# EAGLE design untitled (EAGLE 7.7.0)
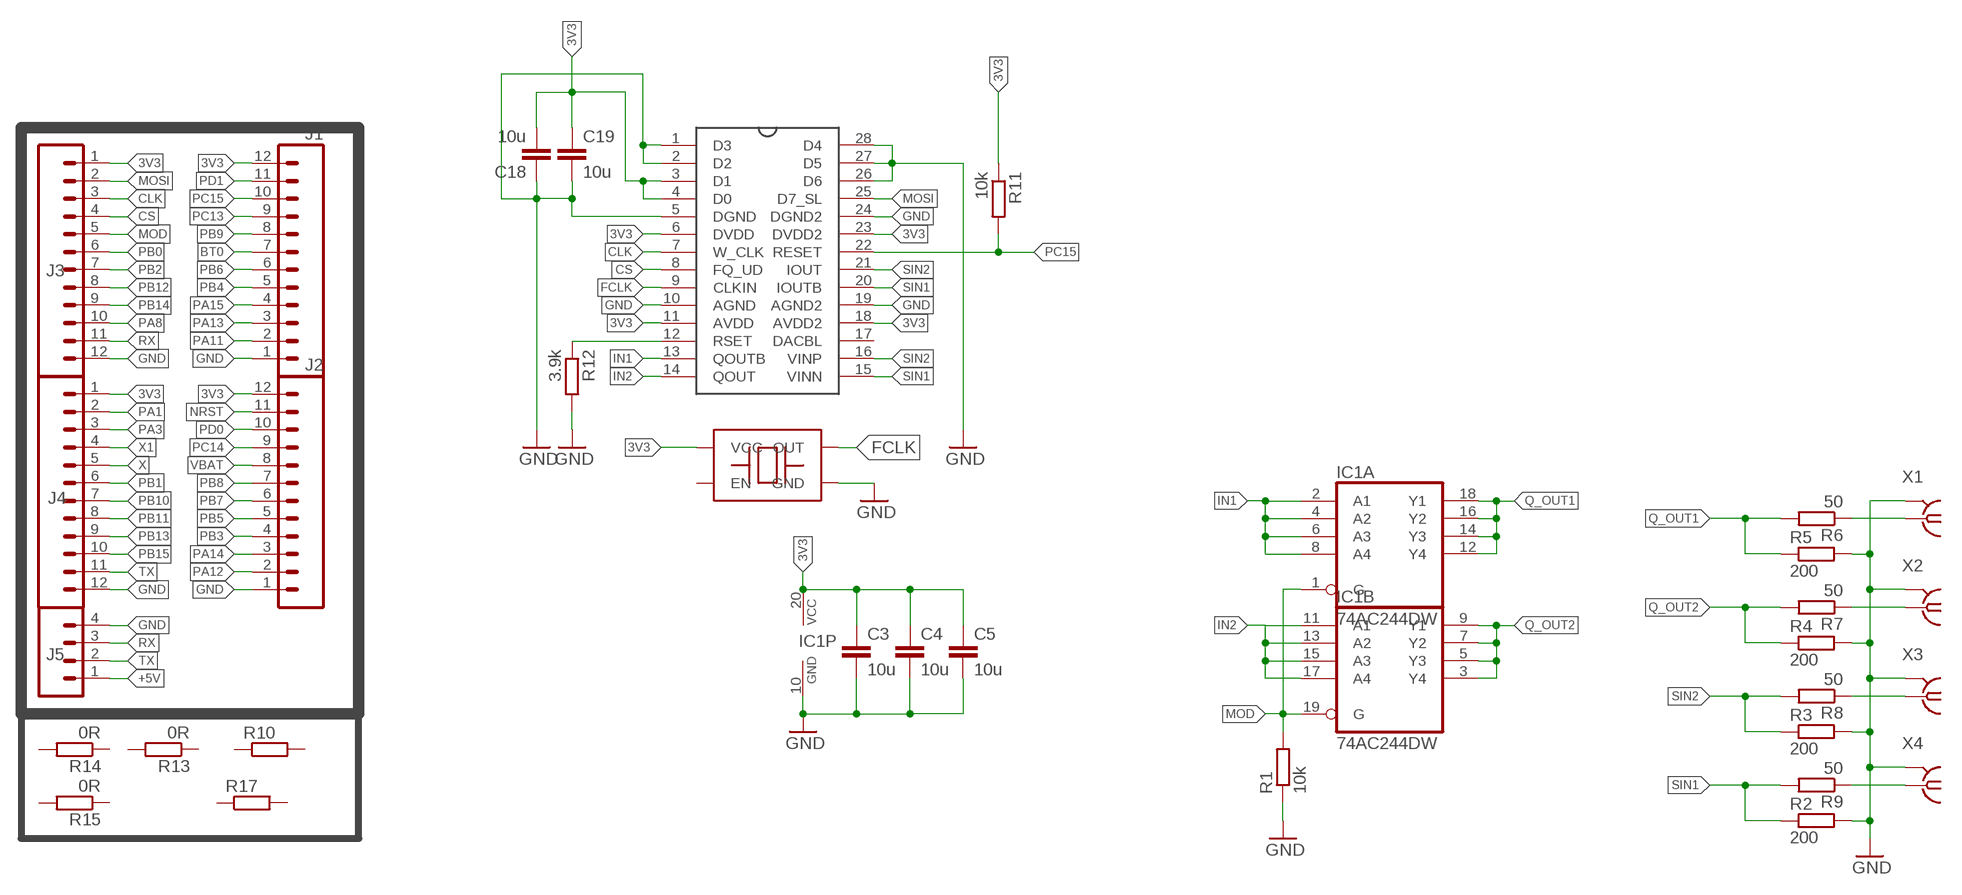
[diagram p0: schematic, sheet 1]

## Parts
C3  10u  C0805  [0805]
C4  10u  C0805  [0805]
C5  10u  C0805  [0805]
C18  10u  C0805  [0805]
C19  10u  C0805  [0805]
IC1  74AC244DW  [SO20W]
J1  M12PTH  [1X12]
J2  M12PTH  [1X12]
J3  M12PTH  [1X12]
J4  M12PTH  [1X12]
J5  M04PTH  [1X04]
R1  10k  R0805  [0805]
R2  200  R0805  [0805]
R3  200  R0805  [0805]
R4  200  R0805  [0805]
R5  200  R0805  [0805]
R6  50  R0805  [0805]
R7  50  R0805  [0805]
R8  50  R0805  [0805]
R9  50  R0805  [0805]
R10  R0805  [0805]
R11  10k  R0805  [0805]
R12  3.9k  R0805  [0805]
R13  0R  R0805  [0805]
R14  0R  R1206  [1206]
R15  0R  R0805  [0805]
R17  R1206  [1206]
U$1  AD9850  [SSOP28]
U$3  TXC-BA  [7X5]
X1  BU-SMA-H  [BU-SMA-H]
X2  BU-SMA-H  [BU-SMA-H]
X3  BU-SMA-H  [BU-SMA-H]
X4  BU-SMA-H  [BU-SMA-H]

## Nets
3V3: C3.1 C4.1 C5.1 C18.2 C19.1 IC1.20(P:VCC) J1.12 J2.12 J3.1 J4.1 R11.1 U$1.3(D1) U$1.4(D0) U$1.6(DVDD) U$1.11(AVDD) U$1.18(AVDD2) U$1.23(DVDD2) U$3.VCC
+5V: J5.1
BT0: J1.7
CLK: J3.3 U$1.7(W_CLK)
CS: J3.4 U$1.8(FQ_UD)
FCLK: U$1.9(CLKIN) U$3.OUT
GND: C3.2 C4.2 C5.2 C18.1 C19.2 IC1.10(P:GND) J1.1 J2.1 J3.12 J4.12 J5.4 R1.1 R2.2 R3.2 R4.2 R5.2 R12.2 U$1.1(D3) U$1.2(D2) U$1.5(DGND) U$1.10(AGND) U$1.19(AGND2) U$1.24(DGND2) U$1.26(D6) U$1.27(D5) U$1.28(D4) U$3.GND X1.2 X1.3 X1.4 X1.5 X2.2 X2.3 X2.4 X2.5 X3.2 X3.3 X3.4 X3.5 X4.2 X4.3 X4.4 X4.5
IN1: IC1.2(A:A1) IC1.4(A:A2) IC1.6(A:A3) IC1.8(A:A4) U$1.13(QOUTB)
IN2: IC1.11(B:A1) IC1.13(B:A2) IC1.15(B:A3) IC1.17(B:A4) U$1.14(QOUT)
MOD: IC1.1(A:G) IC1.19(B:G) J3.5 R1.2
MOSI: J3.2 U$1.25(D7_SL)
N$1: R6.1 X1.1
N$3: R7.1 X2.1
N$6: R8.1 X3.1
N$8: R9.1 X4.1
NRST: J2.11
PA1: J4.2
PA3: J4.3
PA8: J3.10
PA11: J1.2
PA12: J2.2
PA13: J1.3
PA14: J2.3
PA15: J1.4
PB0: J3.6
PB1: J4.6
PB2: J3.7
PB3: J2.4
PB4: J1.5
PB5: J2.5
PB6: J1.6
PB7: J2.6
PB8: J2.7
PB9: J1.8
PB10: J4.7
PB11: J4.8
PB12: J3.8
PB13: J4.9
PB14: J3.9
PB15: J4.10
PC13: J1.9
PC14: J2.9
PC15: J1.10 R11.2 U$1.22(RESET)
PD0: J2.10
PD1: J1.11
Q_OUT1: IC1.12(A:Y4) IC1.14(A:Y3) IC1.16(A:Y2) IC1.18(A:Y1) R5.1 R6.2
Q_OUT2: IC1.3(B:Y4) IC1.5(B:Y3) IC1.7(B:Y2) IC1.9(B:Y1) R4.1 R7.2
R_SET: R12.1 U$1.12(RSET)
RX: J3.11 J5.3
SIN1: R2.1 R9.2 U$1.15(VINN) U$1.20(IOUTB)
SIN2: R3.1 R8.2 U$1.16(VINP) U$1.21(IOUT)
TX: J4.11 J5.2
VBAT: J2.8
X: J4.5
X1: J4.4
Unconnected: R10.1 R10.2 R13.1 R13.2 R14.1 R14.2 R15.1 R15.2 R17.1 R17.2 U$1.17(DACBL) U$3.EN

## Library data of the parts
C3-C5 C18 C19 = smalsmd:C: Capacitor
IC1 = 74xx-eu:74*244: Octal BUFFER and LINE DRIVER, 3-state
J1-J4 = SparkFun-Connectors:M12: Header 12 Standard 12-pin 0.1" header. Use with straight break away headers (SKU : PRT-00116), right angle break away headers (PRT-00553), swiss pins (PRT-00743), machine pins (PRT-00117), and female headers (PRT-00115).
J5 = SparkFun-Connectors:M04: Header 4 Standard 4-pin 0.1" header. Use with straight break away headers (SKU : PRT-00116), right angle break away headers (PRT-00553), swiss pins (PRT-00743), machine pins (PRT-00117), and female headers (PRT-00115). Molex polarized connector foot print use with SKU : PRT-08231 with associated crimp pins and housings. 1MM SMD Version SKU: PRT-10208; PROD_ID: CONN-09696
R1-R15 R17 = smalsmd:R
U$1 = ad9850:AD9850: CMOS, 125 MHz Complete DDS Synthesizer
U$3 = txc:TXC-BA**
X1-X4 = con-coax:BU-SMA-H: FEMALE SMA CONNECTOR Radiall; OC_FARNELL: unknown; OC_NEWARK: unknown

## Board
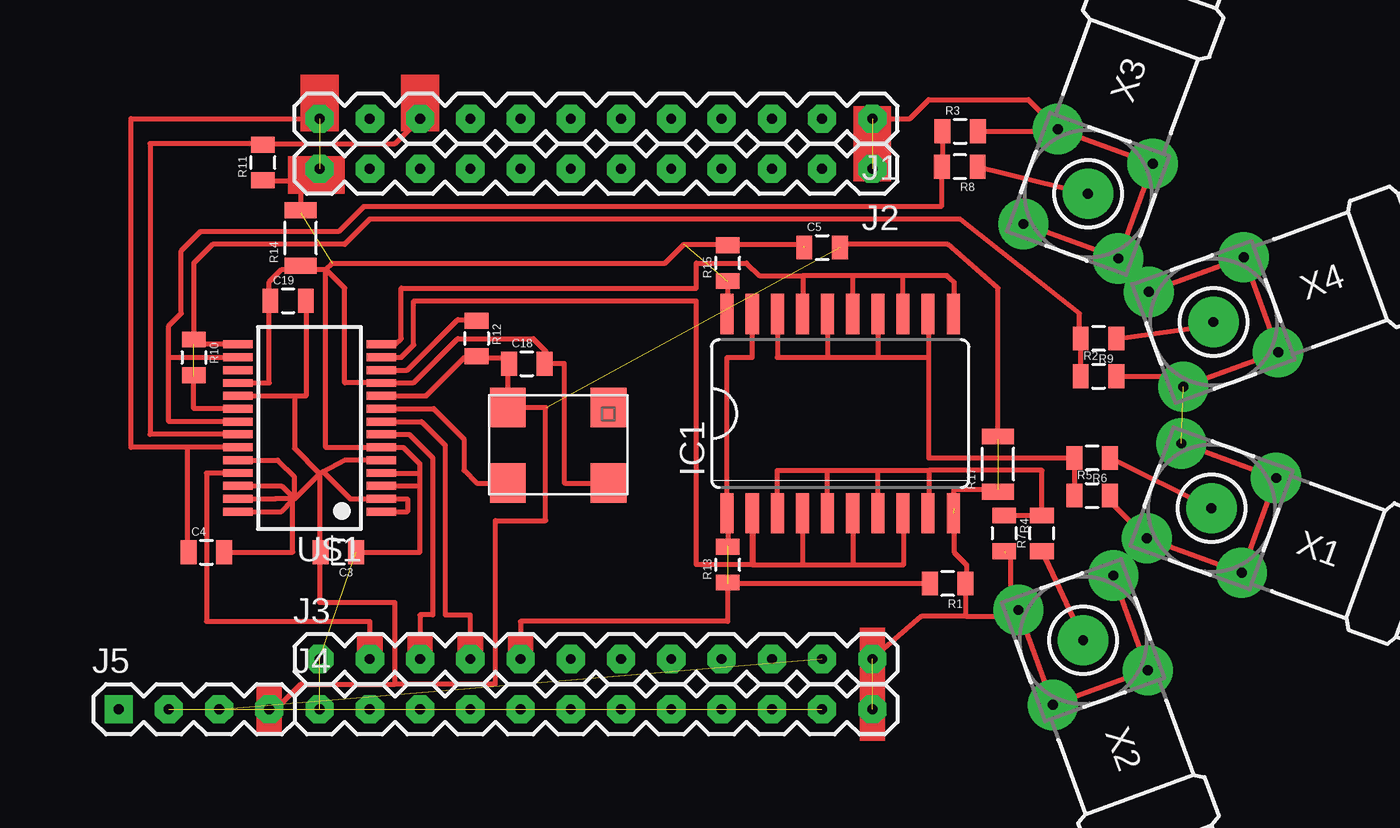
[diagram p1: board, top side]
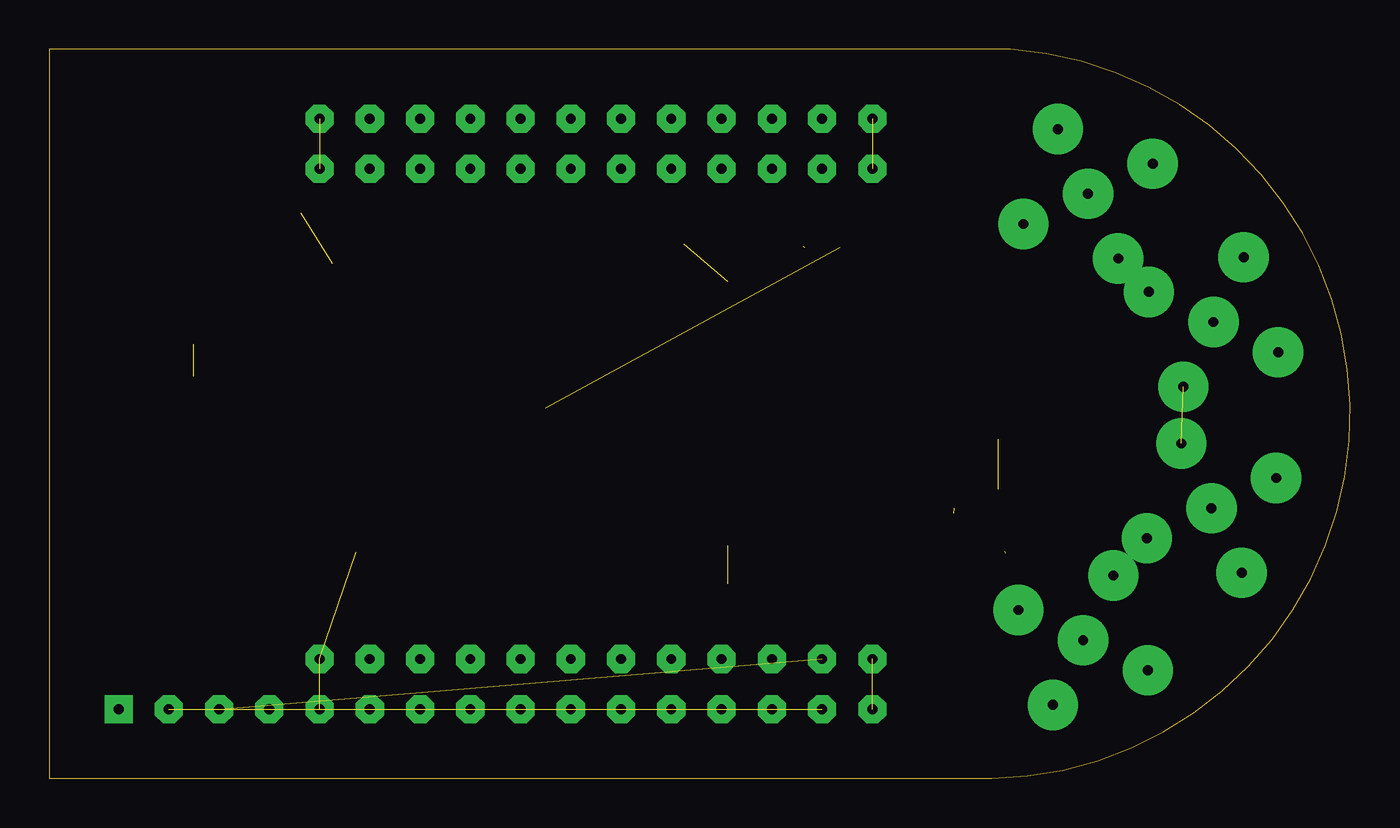
[diagram p2: board, inner layer Route3]

No outline drawn. Coordinates in mm, seen from the top.
Copper layers (1*16): Top 0.035mm / dielectric 1.5mm / Bottom 0.035mm
Design rules "default *": minimum track width 10mil, minimum drill 12.5mil, track to track 0.2mm, track to pad 0.2mm, pad to pad 0.2mm, via to via 0.2mm, smd to smd 0.2mm, copper to edge 40mil, drill to drill 8mil, minimum pad ring 10mil, minimum via ring 8mil, stop-mask expansion 4mil, vias tented up to drill 0mil, thermal gap 10mil

### Footprints (pad centres in the part's own frame; a part is rotated, then mirrored left to right if it is on the bottom)
0805 = smd 0.8 x 1.2: 1 -0.9,0; 2 0.9,0
SO20W = smd 0.66 x 2.032: 1 -5.715,-5.029; 2 -4.445,-5.029; 3 -3.175,-5.029; 4 -1.905,-5.029; 5 -0.635,-5.029; 6 0.635,-5.029; 7 1.905,-5.029; 8 3.175,-5.029; 9 4.445,-5.029; 10 5.715,-5.029; 11 5.715,5.029; 12 4.445,5.029; 13 3.175,5.029; 14 1.905,5.029; 15 0.635,5.029; 16 -0.635,5.029; 17 -1.905,5.029; 18 -3.175,5.029; 19 -4.445,5.029; 20 -5.715,5.029
1X12 = drill 0.5 pad 1.422 octagon: 1 0,0; 2 2.54,0; 3 5.08,0; 4 7.62,0; 5 10.16,0; 6 12.7,0; 7 15.24,0; 8 17.78,0; 9 20.32,0; 10 22.86,0; 11 25.4,0; 12 27.94,0
1X04 = drill 0.5 pad 1.422 square: 1 0,0 | drill 0.5 pad 1.422 octagon: 2 2.54,0; 3 5.08,0; 4 7.62,0
1206 = smd 0.8 x 1.6: 1 -1.4,0; 2 1.4,0
SSOP28 = smd 0.4 x 1.5: 1 -4.225,-3.625; 2 -3.575,-3.625; 3 -2.925,-3.625; 4 -2.275,-3.625; 5 -1.625,-3.625; 6 -0.975,-3.625; 7 -0.325,-3.625; 8 0.325,-3.625; 9 0.975,-3.625; 10 1.625,-3.625; 11 2.275,-3.625; 12 2.925,-3.625; 13 3.575,-3.625; 14 4.225,-3.625; 15 4.225,3.625; 16 3.575,3.625; 17 2.925,3.625; 18 2.275,3.625; 19 1.625,3.625; 20 0.975,3.625; 21 0.325,3.625; 22 -0.325,3.625; 23 -0.975,3.625; 24 -1.625,3.625; 25 -2.275,3.625; 26 -2.925,3.625; 27 -3.575,3.625; 28 -4.225,3.625
7X5 = smd 1.8 x 2: EN 0.953,0.635; GND 6.032,0.635; OUT 6.032,4.445; VCC 0.953,4.445
BU-SMA-H = drill 0.5 pad 2.54: 1 0,0; 2 -2.55,2.55; 3 2.55,2.55; 4 2.55,-2.55; 5 -2.55,-2.55

### Placement (x,y rotation side)
C3  13.65,9.84 180 top
C4  6.99,9.84 0 top
C5  38.1,25.24 0 top
C18  23.18,19.37 0 top
C19  11.11,22.54 0 top
IC1  39.01,16.84 0 top
J1  40.64,31.75 180 top
J2  40.64,29.21 180 top
J3  12.7,4.45 0 top
J4  12.7,1.91 0 top
J5  2.54,1.91 0 top
R1  44.45,8.26 180 top
R2  52.07,18.73 0 top
R3  45.09,31.11 0 top
R4  47.31,10.79 270 top
R5  51.75,12.7 0 top
R6  51.75,14.61 180 top
R7  49.21,10.79 90 top
R8  45.07,29.32 180 top
R9  52.07,20.64 180 top
R10  6.35,19.68 270 top
R11  9.84,29.53 90 top
R12  20.64,20.64 270 top
R13  33.34,9.21 90 top
R14  11.75,25.72 90 top
R15  33.34,24.45 90 top
R17  46.99,14.29 90 top
U$1  12.2,16.12 90 top
U$3  TXC-BA*  [7X5]  28.26,17.78 180 top
X1  57.78,12.06 340 top
X2  51.3,5.39 290 top
X3  51.55,27.95 70 top
X4  57.89,21.47 20 top

### Tracks (layer width: path | path; a pad name or v marks a point on that pad's centre or on a via)
3V3  (6 unrouted)
  Top 0.254: 8.57,18.41 U$1.18 10.16,18.39 10.16,22.49 | 15.82,18.41 U$1.11 | 13.02,24.13 10.79,24.13 10.16,23.5 10.16,22.49 | IC1.20 33.34,21.87 33.34,23.5 | U$1.23 6.03,15.14 | 6.03,15.14 3.17,15.14 3.17,31.75 J1.12 | C4.1 6.03,9.84 6.03,15.14 | 13.02,24.13 13.02,15.14 U$1.6 16.93,15.14 17.78,14.29 17.78,13.84 | 13.02,24.13 13.97,23.18 13.97,18.39 U$1.11 | 10.16,22.49 C19.1 | 11.75,28.57 9.89,28.57 R11.1 | J2.12 11.75,29.21 11.75,28.57 | 11.75,28.57 11.75,26.99 | U$1.11 15.85,18.41 17.46,18.41 19.68,20.64 23.5,20.64 24.13,20 24.13,19.42 C18.2 24.13,19.32 24.13,19.37 25.08,19.37 25.08,13.34 U$3.VCC | 13.02,24.13 13.34,24.45 30.16,24.45 31.11,25.4 37.15,25.4 37.15,25.29 | 14.61,9.89 C3.1 17.78,9.84 17.78,13.19 | U$1.4 17.78,13.84 | U$1.3 17.78,13.19 | 17.78,13.19 17.78,13.84
CLK
  Top 0.254: U$1.7 17.23,15.79 18.41,14.61 18.41,6.67 17.78,6.67 J3.3
CS
  Top 0.254: U$1.8 17.85,16.44 19.05,15.24 19.05,6.67 20.32,6.67 J3.4
FCLK
  Top 0.254: U$1.9 18.47,17.09 20,15.56 20,13.97 20.64,13.34 U$3.OUT
GND  (7 unrouted)
  Top 0.254: U$1.28 10.78,11.89 11.35,12.46 | U$1.27 10.48,12.54 11.43,12.54 | U$1.26 10.78,13.19 11.43,12.54 | 9.21,17.78 9.21,17.74 U$1.19 11.43,17.74 | IC1.10 44.77,11.81 44.77,9.84 45.4,9.21 45.4,8.31 R1.1 45.35,6.65 45.4,6.6 | U$1.24 10.59,14.49 11.43,13.65 11.43,12.54 | 11.43,17.74 11.43,15.08 12.7,13.81 | 15.82,17.78 U$1.10 18.1,17.74 20.04,19.68 20.37,19.68 | J1.1 42.55,31.75 43.5,32.7 48.54,32.7 X3.3 | X3.3 X3.4 X3.5 | X3.5 X3.2 | X3.5 X4.2 | X4.2 X4.3 X4.4 X4.5 56.36,18.73 R2.2 | X2.5 X2.4 X2.3 X2.2 X1.5 | X1.5 X1.4 X1.3 X1.2 | R3.2 49.92,31.11 X3.3 | 54.61,22.54 X4.2 | 11.35,12.46 11.43,12.54 | 11.43,12.54 12.7,13.81 | C4.2 11.35,9.84 11.35,12.46 | J5.4 10.48,1.91 11.75,3.17 16.51,3.17 | 16.51,3.17 16.51,7.3 12.7,7.3 12.7,9.84 12.7,13.81 | 16.51,3.17 21.59,3.17 21.59,11.43 24.13,11.43 24.13,17.14 U$3.GND 22.23,19.37 22.23,19.63 20.74,19.63 20.37,19.68 | 45.4,6.6 43.11,6.6 J3.12 | 47.36,9.79 47.62,9.53 47.62,7.32 X2.5 | R5.2 52.65,12.4 X1.5 | 46.99,15.56 46.99,23.18 44.45,25.4 39.05,25.4 39.05,25.29 | 44.77,12.06 44.77,13.02 46.99,13.02 | 11.43,17.74 12.01,17.74 12.01,22.49 12.06,22.49 C19.2 | 20.37,19.68 R12.2 | U$1.5 13.97,14.49 12.88,13.91 | U$1.1 17.14,11.89 17.14,12.54 U$1.2 14.25,12.54 12.88,13.91 | 12.88,13.91 12.7,13.81 | 45.4,6.6 48.03,6.6 X2.5
  Top 0.406: C3.2 12.7,9.84 | C18.1 22.23,19.37 | C5.2 39.05,25.24 39.05,25.4
IN1
  Top 0.254: 34.57,9.21 IC1.2 34.61,11.81 34.61,9.21 | 34.57,9.21 34.61,9.21 | 34.61,9.21 37.11,9.21 | 37.11,9.21 39.65,9.21 | 39.65,9.21 42.23,9.21 42.23,11.81 IC1.8 | IC1.4 37.11,9.21 | IC1.6 39.65,9.21 | 34.57,9.21 31.75,9.21 31.75,22.54 17.46,22.54 17.46,20.32 16.83,19.68 U$1.13
IN2
  Top 0.254: 42.19,23.81 44.41,23.81 44.77,23.5 IC1.11 | 42.19,23.81 39.65,23.81 | 37.15,21.87 IC1.17 37.15,21.91 37.15,23.81 | IC1.13 42.19,23.81 | 37.15,23.81 34.92,23.81 34.29,24.45 31.75,24.45 31.75,23.18 16.83,23.18 16.83,20.64 16.53,20.34 U$1.14 | IC1.15 39.65,23.81 | 39.65,23.81 37.15,23.81
MOD  (1 unrouted)
  Top 0.254: IC1.19 34.57,19.68 33.3,19.68 IC1.1 33.34,11.81 33.34,10.16 | 43.81,8.26 R1.2 43.5,8.26 33.34,8.26 33.34,6.35 22.86,6.35 J3.5
MOSI
  Top 0.254: U$1.25 6.99,13.84 6.99,6.35 15.24,6.35 J3.2
N$1
  Top 0.254: R6.1 X1.1
N$2
  Route3 0: 47.62,35.24 -0.95,35.24 -0.95,-1.59 46.67,-1.59 arc175 47.62,35.24
N$3
  Top 0.254: R7.1 X2.1
N$6
  Top 0.254: R8.1 X3.1
N$8
  Top 0.254: R9.1 57.69,21.27 X4.1
PC15
  Top 0.254: U$1.22 4.13,15.79 4.13,30.48 9.79,30.48 R11.2 | 9.84,30.48 R11.2 | R11.2 10.11,30.43 10.16,30.48 16.51,30.48 J1.10
Q_OUT1
  Top 0.254: IC1.14 40.92,19.68 | 40.92,19.68 43.5,19.68 | 43.5,19.68 43.5,21.87 IC1.12 | IC1.16 38.38,19.68 | 38.38,19.68 40.92,19.68 | IC1.18 35.84,19.68 38.38,19.68 | 43.5,19.68 43.5,14.61 R6.2 R5.1
Q_OUT2
  Top 0.254: IC1.3 35.84,13.97 38.38,13.97 | 38.38,13.97 40.92,13.97 | 40.92,13.97 43.5,13.97 | 43.5,13.97 43.5,11.81 IC1.9 | IC1.7 40.92,13.97 | IC1.5 38.38,13.97 | 43.5,13.97 49.21,13.97 R7.2 R4.1
R_SET
  Top 0.254: U$1.12 17.14,19.04 19.68,21.59 20.32,21.59 R12.1
RX  (1 unrouted)
SIN1  (1 unrouted)
  Top 0.254: U$1.20 6.35,17.09 6.35,18.73 | U$1.15 6.35,20.34 | 6.35,20.34 6.35,20.32 | R9.2 51.12,20.64 | R2.1 R9.2 | R9.2 51.12,20.69 51.12,21.91 45.09,26.67 15.24,26.67 13.97,25.4 7.3,25.4 6.35,24.45 6.35,20.34
SIN2
  Top 0.254: R3.1 44.19,29.66 R8.2 44.13,29.32 44.13,27.3 14.92,27.3 13.65,26.04 6.67,26.04 5.71,25.08 5.71,21.91 5.08,21.27 5.08,19.68 | 5.08,19.68 U$1.16 | U$1.21 5.08,16.44 5.08,19.68
TX  (1 unrouted)
(copper drawn outside any net)
  shapes: Top area x10